# EAGLE design chipchestra-v05-analog-inputs (EAGLE 8.0.1)
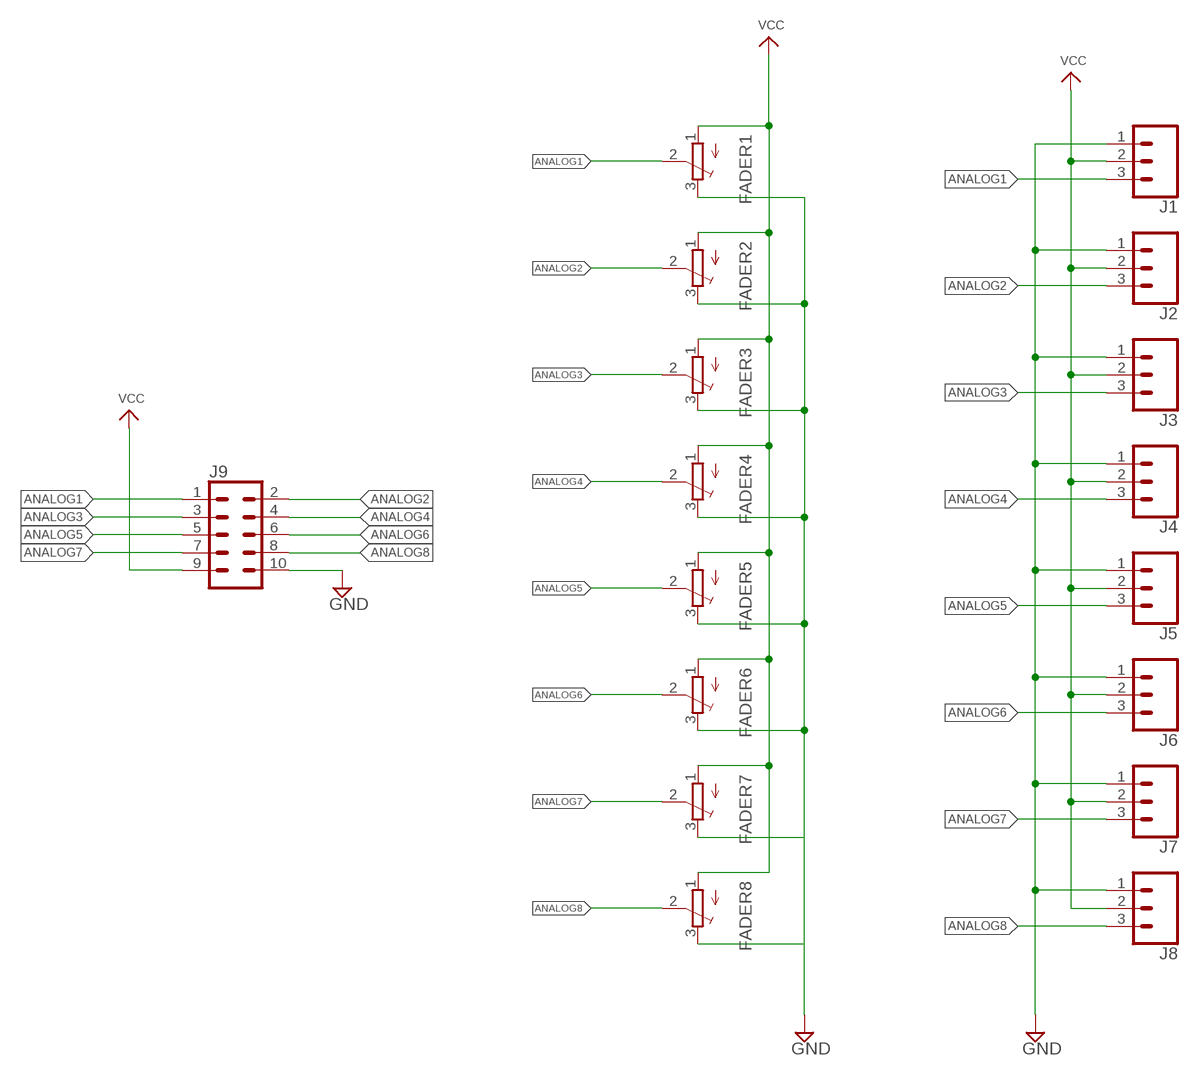
[diagram p0: schematic, sheet 1]

## Parts
FADER1  TRIMPOT3386  [TRIM-3386]
FADER2  TRIMPOT3386  [TRIM-3386]
FADER3  TRIMPOT3386  [TRIM-3386]
FADER4  TRIMPOT3386  [TRIM-3386]
FADER5  TRIMPOT3386  [TRIM-3386]
FADER6  TRIMPOT3386  [TRIM-3386]
FADER7  TRIMPOT3386  [TRIM-3386]
FADER8  TRIMPOT3386  [TRIM-3386]
J1  CONN_03LOCK  [1X03_LOCK]
J2  CONN_03LOCK  [1X03_LOCK]
J3  CONN_03LOCK  [1X03_LOCK]
J4  CONN_03LOCK  [1X03_LOCK]
J5  CONN_03LOCK  [1X03_LOCK]
J6  CONN_03LOCK  [1X03_LOCK]
J7  CONN_03LOCK  [1X03_LOCK]
J8  CONN_03LOCK  [1X03_LOCK]
J9  CONN_05X2SHD_LOCK  [2X5-SHROUDED_LOCK]

## Nets
ANALOG1: FADER1.2(S) J1.3 J9.1
ANALOG2: FADER2.2(S) J2.3 J9.2
ANALOG3: FADER3.2(S) J3.3 J9.3
ANALOG4: FADER4.2(S) J4.3 J9.4
ANALOG5: FADER5.2(S) J5.3 J9.5
ANALOG6: FADER6.2(S) J6.3 J9.6
ANALOG7: FADER7.2(S) J7.3 J9.7
ANALOG8: FADER8.2(S) J8.3 J9.8
GND: FADER1.3(E) FADER2.3(E) FADER3.3(E) FADER4.3(E) FADER5.3(E) FADER6.3(E) FADER7.3(E) FADER8.3(E) J1.1 J2.1 J3.1 J4.1 J5.1 J6.1 J7.1 J8.1 J9.10
VCC: FADER1.1(A) FADER2.1(A) FADER3.1(A) FADER4.1(A) FADER5.1(A) FADER6.1(A) FADER7.1(A) FADER8.1(A) J1.2 J2.2 J3.2 J4.2 J5.2 J6.2 J7.2 J8.2 J9.9

## Library data of the parts
FADER1-FADER8 = adafruit:TRIMPOT: SMT trimmer potentiometer part number TC33X http://www.ladyada.net/library/eagle
J1-J8 = SparkFun-Connectors:CONN_03: Multi connection point. Often used as Generic Header-pin footprint for 0.1 inch spaced/style header connections On any of the 0.1 inch spaced packages, you can populate with these: Break Away Headers - Straight <https://www.sparkfun.com/products/116> (PRT-00116) Break Away Male Headers - Right Angle <https://www.sparkfun.com/products/553> (PRT-00553) Female Headers <https://www.sparkfun.com/products/115> (PRT-00115) Break Away Headers - Machine Pin <https://www.sparkfun.com/products/117> (PRT-00117) Break Away Female Headers - Swiss Machine Pin <https://www.sparkfun.com/products/743> (PRT-00743) Stackable Header - 3 Pin (Female, 0.1") <https://www.sparkfun.com/products/13875> (PRT-13875) For SCREWTERMINALS and SPRING TERMINALS visit here: Screw Terimnals on SparkFun.com <https://www.sparkfun.com/search/results?term=Screw+Terminals> (5mm/3.5mm/2.54mm spacing) This device is also useful as a general connection point to wire up your design to another part of your project. Our various solder wires solder well into these plated through hole pads. Hook-Up Wire - Assortment (Stranded, 22 AWG) <https://www.sparkfun.com/products/11375> (PRT-11375) Hook-Up Wire - Assortment (Solid Core, 22 AWG) <https://www.sparkfun.com/products/11367> (PRT-11367) View the entire wire category on our website here <https://www.sparkfun.com/categories/141> Special notes: Molex polarized connector foot print use with SKU : PRT-08232 with associated crimp pins and housings.
J9 = SparkFun-Connectors:CONN_05X2: Multi connection point. Often used as Generic Header-pin footprint for 0.1 inch spaced/style header connections For AVR SPI programming port, see special device with nice symbol: "AVR_SPI_PROG_5x2.dev" You can populate with any combo of single row headers, but if you'd like an exact match, check these: 2x5 AVR ICSP Male Header <https://www.sparkfun.com/products/778> (PRT-00778) 2x5 Pin Shrouded Header <https://www.sparkfun.com/products/8506> (PRT-08506) On any of the 0.1 inch spaced packages, you can populate with these: Break Away Headers - Straight <https://www.sparkfun.com/products/116> (PRT-00116) Break Away Male Headers - Right Angle <https://www.sparkfun.com/products/553> (PRT-00553) Female Headers <https://www.sparkfun.com/products/115> (PRT-00115) Break Away Headers - Machine Pin <https://www.sparkfun.com/products/117> (PRT-00117) Break Away Female Headers - Swiss Machine Pin <https://www.sparkfun.com/products/743> (PRT-00743) Special note: the shrouded connector mates well with our 5x2 ribbon cables: 2x5 Pin IDC Ribbon Cable <https://www.sparkfun.com/products/8535> (PRT-08535); PROD_ID: CONN-08671; SF_ID: PRT-08506

## Net classes
0 default: width 0.254 mm, clearance 0.152 mm

## Board
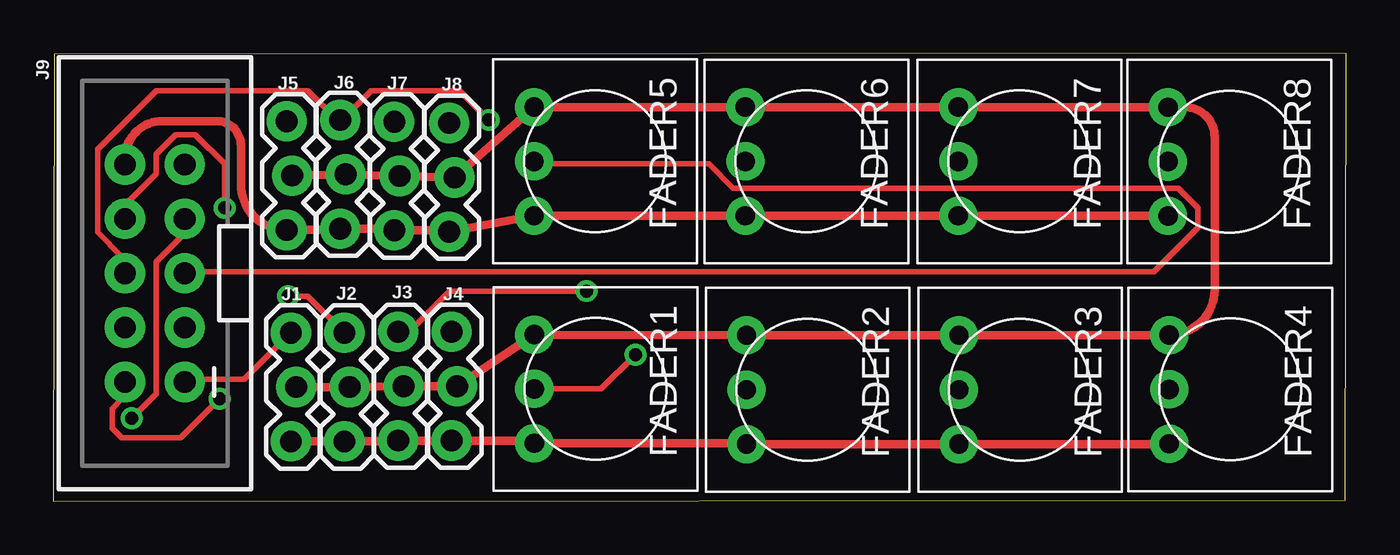
[diagram p1: board, top side]
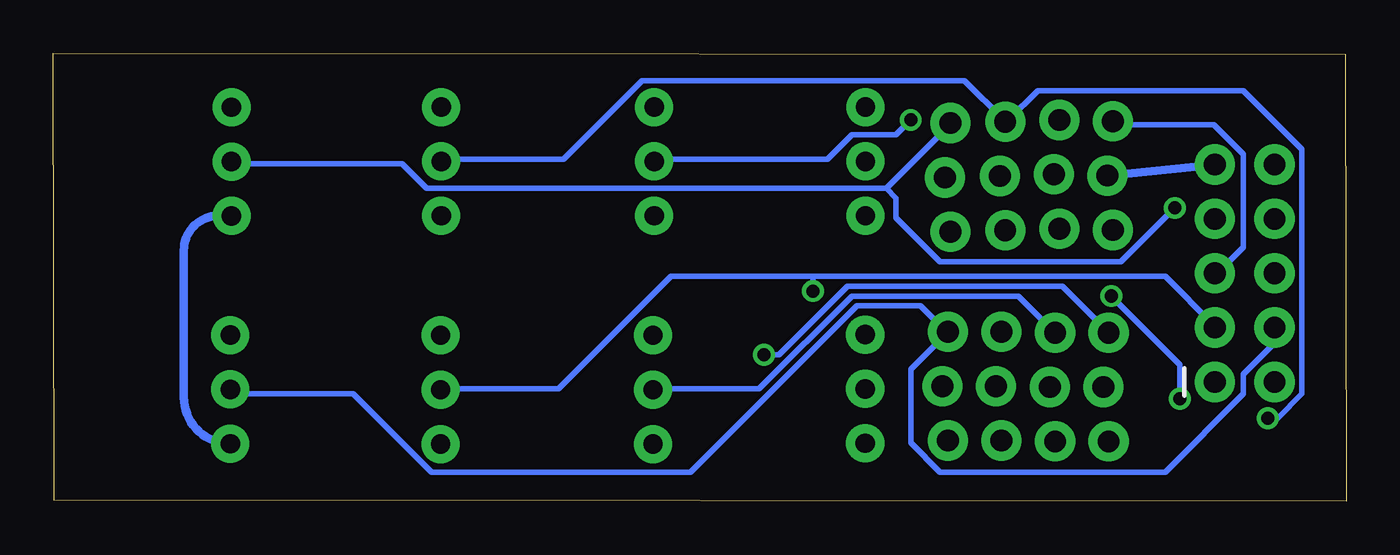
[diagram p2: board, bottom side, seen from below]

Size 60.42 x 20.91 mm. Coordinates in mm from the lower left corner, seen from the top.
Outline: 0.03,20.89 0,0 60.4,0.03 60.42,20.91 0.03,20.89
Copper layers (1*16): Top 0.035mm / dielectric 1.5mm / Bottom 0.035mm
Design rules "default": minimum track width 10mil, minimum drill 24mil, track to track 8mil, track to pad 8mil, pad to pad 8mil, via to via 8mil, smd to smd 8mil, copper to edge 40mil, drill to drill 8mil, minimum pad ring 10mil, minimum via ring 8mil, stop-mask expansion 4mil, vias tented up to drill 0mil, thermal gap 10mil

### Footprints (pad centres in the part's own frame; a part is rotated, then mirrored left to right if it is on the bottom)
TRIM-3386 = drill 0.9 pad 1.778: 1 -2.54,-2.857; 2 0,-2.857; 3 2.54,-2.857
1X03_LOCK = drill 1.016 pad 1.88: 1 0,0.127; 2 2.54,-0.127; 3 5.08,0.127
2X5-SHROUDED_LOCK = drill 1.016 pad 1.88: 1 -1.397,5.08; 2 1.397,5.08; 3 -1.397,2.54; 4 1.397,2.54; 5 -1.397,0; 6 1.397,0; 7 -1.397,-2.54; 8 1.397,-2.54; 9 -1.397,-5.08; 10 1.397,-5.08

### Placement (x,y rotation side)
FADER1  25.33,5.24 270 top
FADER2  35.26,5.2 270 top
FADER3  45.19,5.2 270 top
FADER4  55.01,5.21 270 top
FADER5  25.32,15.87 270 top
FADER6  35.2,15.87 270 top
FADER7  45.15,15.87 270 top
FADER8  54.96,15.87 270 top
J1  11.22,2.79 90 top
J2  13.72,2.79 90 top
J3  16.24,2.83 90 top
J4  18.74,2.83 90 top
J5  11.03,12.67 90 top
J6  13.53,12.73 90 top
J7  16.06,12.65 90 top
J8  18.62,12.58 90 top
J9  4.74,10.65 180 top

### Tracks (layer width: path | path; a pad name or v marks a point on that pad's centre or on a via)
ANALOG1  (via drill 0.61)
  Top 0.254: FADER1.2 25.6,5.24 v27.2,6.84 | J9.1 6.17,5.7 8.91,5.7 10.97,7.75 J1.3
  Bottom 0.254: v27.2,6.84 26.52,6.84 23.32,10.04 13.26,10.04 11.2,7.98 J1.3
ANALOG2  (via drill 0.61)
  Top 0.254: v7.77,4.78 5.94,2.95 3.2,2.95 2.74,3.41 2.74,4.32 3.2,4.78 3.2,5.47 J9.2 | v10.97,9.58 11.89,9.58 13.49,7.98 J2.3
  Bottom 0.254: FADER2.2 32.23,5.24 27.43,5.24 23.09,9.58 15.32,9.58 13.72,7.98 J2.3 | v7.77,4.78 7.77,6.38 v10.97,9.58
ANALOG3  (via drill 0.61)
  Top 0.254: v24.92,9.81 18.52,9.81 16.69,7.98 16.23,7.98 J3.3
  Bottom 0.254: 24.92,10.5 8.46,10.5 6.17,8.21 J9.3 | 24.92,10.5 31.55,10.5 36.8,5.24 42.29,5.24 FADER3.2 | 24.92,10.5 v24.92,9.81
ANALOG4
  Bottom 0.254: FADER4.2 52.12,5.01 46.41,5.01 42.75,1.35 30.63,1.35 22.86,9.12 19.89,9.12 18.75,7.98 J4.3 18.75,7.75 20.34,6.15 20.34,2.72 18.97,1.35 8.46,1.35 4.8,5.01 4.8,5.92 3.43,7.3 3.43,7.98 J9.4
ANALOG5
  Top 0.254: FADER5.2 22.63,15.75 30.63,15.75 31.77,14.61 52.58,14.61 53.49,13.7 53.49,12.78 51.44,10.72 6.17,10.72 J9.5
  Bottom 0.254: J5.3 10.74,17.58 6.17,17.58 4.8,16.21 4.8,11.87 5.94,10.72 J9.5
ANALOG6  (via drill 0.61)
  Top 0.254: v20.34,17.81 18.97,19.18 14.86,19.18 13.49,17.81 J6.3 13.26,17.81 11.89,19.18 4.8,19.18 2.06,16.44 2.06,12.55 3.2,11.41 3.2,10.72 J9.6
  Bottom 0.254: v20.34,17.81 21.03,17.12 23.09,17.12 24.23,15.98 32.23,15.98 FADER6.2
ANALOG7  (via drill 0.61)
  Top 0.254: v3.66,3.87 4.8,5.01 4.8,11.18 5.94,12.32 5.94,13.01 J9.7
  Bottom 0.254: FADER7.2 42.29,15.98 36.58,15.98 32.92,19.64 17.83,19.64 16,17.81 J7.3 15.77,17.81 14.4,19.18 4.8,19.18 2.06,16.44 2.06,5.01 3.2,3.87 v3.66,3.87
ANALOG8  (via drill 0.61)
  Top 0.254: v8,13.7 8,15.75 6.63,17.12 5.71,17.12 4.8,16.21 4.8,15.3 3.43,13.93 3.43,13.24 J9.8
  Bottom 0.254: 21.49,14.61 42.98,14.61 44.12,15.75 51.89,15.75 FADER8.2 | 21.49,14.61 18.52,17.58 J8.3 | v8,13.7 10.52,11.18 18.97,11.18 21.03,13.24 21.03,14.15 21.49,14.61
GND
  Top 0.406: J1.1 J2.1 16.07,2.79 arc90 J3.1 J4.1 22.35,2.83 arc-90 FADER1.3 32.36,2.7 arc-90 FADER2.3 FADER3.3 arc90 FADER3.3 FADER4.3 arc90 FADER4.3 | FADER8.3 FADER7.3 FADER6.3 FADER5.3 J8.1 arc90 18.43,12.65 J7.1 arc90 15.85,12.73 J6.1 arc-90 13.34,12.67 J5.1 arc-90 8.76,14.8 8.76,16.62 arc90 7.62,17.76 5.08,17.76 arc90 3.34,16.02 J9.10
  Bottom 0.406: FADER8.3 52.72,13.33 arc-90 54.33,11.71 54.33,4.85 arc-90 FADER4.3
VCC
  Top 0.406: J5.2 J6.2 J7.2 J8.2 FADER5.1 FADER6.1 FADER7.1 FADER8.1 52.9,18.41 arc-90 54.28,17.02 54.28,9.88 arc-90 FADER4.1 FADER3.1 FADER2.1 FADER1.1 J4.2 J3.2 J2.2 J1.2
  Bottom 0.406: J9.9 J5.2